# Altium schematic sheet CLK_GEN.SchDoc: Clock generation
size 420 x 297 mm; Author: P. Zdunek; DrawnBy: P. Zdunek; DocumentNumber: 17; SheetNumber: 17; SheetTotal: 37; ModifiedBy: -; CheckedDate: -; Title2: Fast Stabilizer; DivGrp: WUT ISE; Designer: G.Kasprowicz
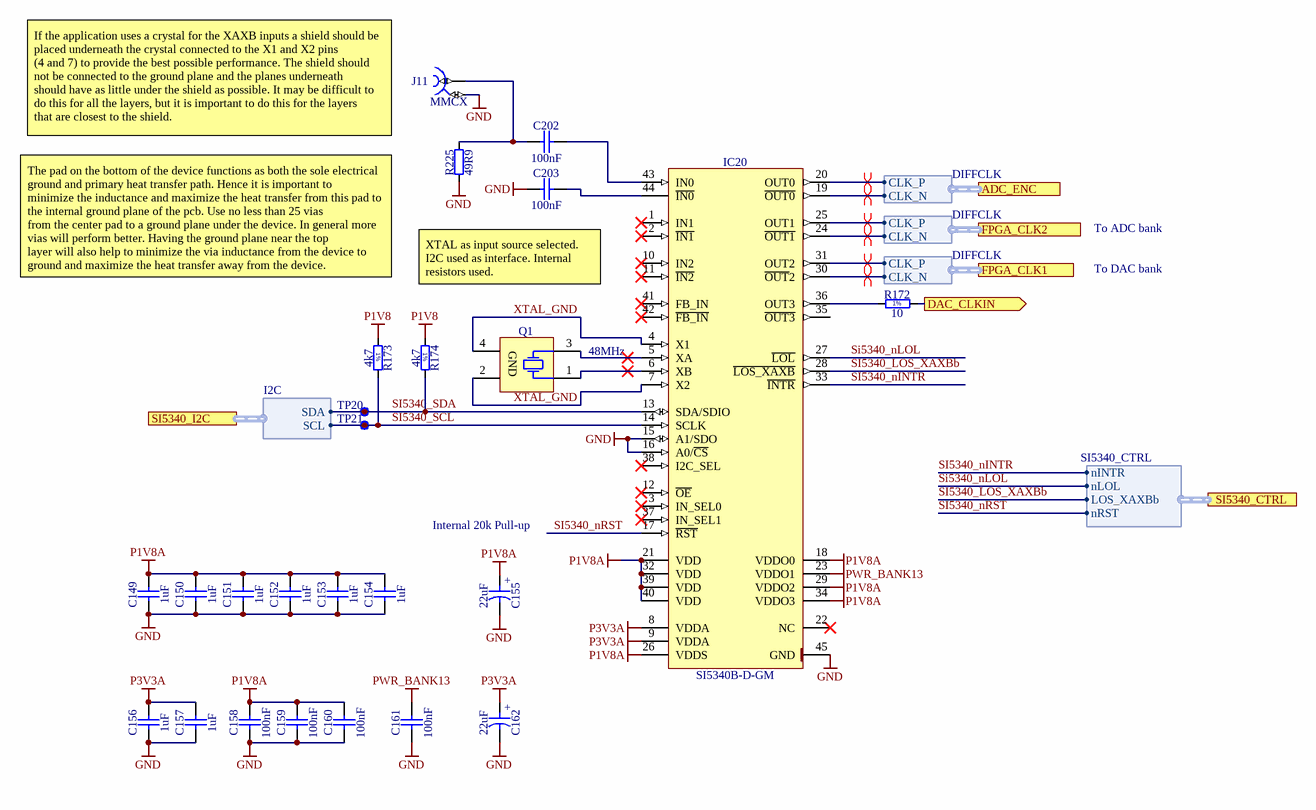
[diagram p0: CLK_GEN.SchDoc]

## Parts
C149  1uF  [CAPC1005X55N]
C150  1uF  [CAPC1005X55N]
C151  1uF  [CAPC1005X55N]
C152  1uF  [CAPC1005X55N]
C153  1uF  [CAPC1005X55N]
C154  1uF  [CAPC1005X55N]
C155  22uF  [CAPMP3216X180N]
C156  1uF  [CAPC1005X55N]
C157  1uF  [CAPC1005X55N]
C158  100nF  [CAPC1005X55N]
C159  100nF  [CAPC1005X55N]
C160  100nF  [CAPC1005X55N]
C161  100nF  [CAPC1005X55N]
C162  22uF  [CAPMP3216X180N]
C202  100nF  [CAPC1005X55N]
C203  100nF  [CAPC1005X55N]
IC20  SI5340B-D-GM  [QFN50P700X700X90-45N-S530]
J11  MMCX  [SAMTEC_MMCX-J-P-H-ST-TH1]
Q1  48MHz  [XTAL_TXC_7M]
R172  10  [RESC1005X40N]
R173  4k7  [RESC1005X40N]
R174  4k7  [RESC1005X40N]
R225  49R9  [RESC1005X40N]
TP20  SMD Pad  [C100]  (value not drawn)  (no BOM)
TP21  SMD Pad  [C100]  (value not drawn)  (no BOM)

## Ports
ADC_ENC (harness DIFFCLK), DAC_CLKIN (out), FPGA_CLK1 (harness DIFFCLK), FPGA_CLK2 (harness DIFFCLK), SI5340_CTRL (harness SI5340_CTRL), SI5340_I2C (harness I2C)

## Harnesses
SI5340_CTRL: nINTR, nLOL, LOS_XAXBb, nRST
I2C: SDA, SCL
DIFFCLK: CLK_P, CLK_N

## Nets
GND: C149.1 C150.1 C151.1 C152.1 C153.1 C154.1 C155.2 C156.1 C157.1 C158.1 C159.1 C160.1 C161.1 C162.2 C203.1 IC20.15(A1/SDO) IC20.16(A0/~{CS}) IC20.45(GND) J11.2 R225.1
P1V8: R173.1 R174.1
P1V8A: C149.2 C150.2 C151.2 C152.2 C153.2 C154.2 C155.1 C158.2 C159.2 C160.2 IC20.18(VDDO0) IC20.21(VDD) IC20.26(VDDS) IC20.29(VDDO2) IC20.32(VDD) IC20.34(VDDO3) IC20.39(VDD) IC20.40(VDD)
P3V3A: C156.2 C157.2 C162.1 IC20.8(VDDA) IC20.9(VDDA)
PWR_BANK13: C161.2 IC20.23(VDDO1)
DAC_CLKIN: R172.2 ; port DAC_CLKIN
SI5340_LOS_XAXBb: IC20.28(~{LOS_XAXB}) ; port SI5340_CTRL.LOS_XAXBb
SI5340_nINTR: IC20.33(~{INTR}) ; port SI5340_CTRL.nINTR
Si5340_nLOL: IC20.27(~{LOL}) ; port SI5340_CTRL.nLOL
SI5340_nRST: IC20.17(~{RST}) ; port SI5340_CTRL.nRST
SI5340_SCL: IC20.14(SCLK) R173.2 TP21.1 ; port SI5340_I2C.SCL
SI5340_SDA: IC20.13(SDA/SDIO) R174.2 TP20.1 ; port SI5340_I2C.SDA
XTAL_GND: IC20.4(X1) IC20.7(X2) Q1.2(GND) Q1.4(GND)
NetC202_1: C202.1 J11.1 R225.2
NetC202_2: C202.2 IC20.43(IN0)
NetC203_2: C203.2 IC20.44(~{IN0})
NetIC20_5: IC20.5(XA) Q1.3(X)
NetIC20_6: IC20.6(XB) Q1.1(X)
NetIC20_19: IC20.19(~{OUT0}) ; port ADC_ENC.CLK_N
NetIC20_20: IC20.20(OUT0) ; port ADC_ENC.CLK_P
NetIC20_24: IC20.24(~{OUT1}) ; port FPGA_CLK2.CLK_N
NetIC20_25: IC20.25(OUT1) ; port FPGA_CLK2.CLK_P
NetIC20_30: IC20.30(~{OUT}2) ; port FPGA_CLK1.CLK_N
NetIC20_31: IC20.31(OUT2) ; port FPGA_CLK1.CLK_P
NetIC20_36: IC20.36(OUT3) R172.1

Not connected (* = marked no-connect by the designer): IC20 1(IN1)* 2(~{IN1})* 3(IN_SEL0)* 10(IN2)* 11(~{IN2})* 12(~{OE})* 22(NC)* 35(~{OUT3}) 37(IN_SEL1)* 38(I2C_SEL)* 41(FB_IN)* 42(~{FB_IN})*

## Layout directives
differential pair: NetIC20_19, NetIC20_20, NetIC20_24, NetIC20_25, NetIC20_30, NetIC20_31

## Notes on the sheet
- If the application uses a crystal for the XAXB inputs a shield should be placed underneath the crystal connected to the X1 and X2 pins
  (4 and 7) to provide the best possible performance. The shield should not be connected to the ground plane and the planes underneath
  should have as little under the shield as possible. It may be difficult to do this for all the layers, but it is important to do this for the layers
  that are closest to the shield.
- To ADC bank
- The pad on the bottom of the device functions as both the sole electrical ground and primary heat transfer path. Hence it is important to
  minimize the inductance and maximize the heat transfer from this pad to the internal ground plane of the pcb. Use no less than 25 vias
  from the center pad to a ground plane under the device. In general more vias will perform better. Having the ground plane near the top
  layer will also help to minimize the via inductance from the device to ground and maximize the heat transfer away from the device.
- XTAL as input source selected. I2C used as interface. Internal resistors used.
- To DAC bank
- Internal 20k Pull-up
- Project/Equipment
- Document
- Designer
- Drawn by
- Check.by
- Copyright WUT ISE 2020.
  This documentation describes Open Hardware and is licensed under the CERN OHL v.1.2. You may redistribute and modify this documentation under the terms of the CERN OHL v.1.2. (http://ohwr.org/CERNOHL). This documentation is distributed WITHOUT ANY EXPRESS OR IMPLIED WARRANTY, INCLUDING OF MERCHANTABILITY, SATISFACTORY QUALITY AND FITNESS FOR A PARTICULAR PURPOSE. Please see the CERN OHL v.1.2 for applicable conditions.
- Contact
- File
- Last Mod.
- Print Date
- Sheet
- Size
- A3
- of
- Rev
- (in symbol CTE3216-18_22UF_10V_10%) +
- (in symbol R0402_4K7_1%_0.0625W_100PPM) 1%
- (in symbol R0402_10R_1%_0.0625W_200PPM) 1%

## Library data of the parts
C149-C154 C156 C157 = CC0402_1UF_16V_10%_X5R: Non-polarised capacitor; Part Description: SMD Multilayer Chip Ceramic Capacitor; Manufacturer: GENERIC; Manufacturer1 Part Number: C1005X5R1C105KT; Voltage: 16V; TC: X5R; Tolerance: ±10%; Part Number: CC0402_1UF_16V_10%_X5R; Component Kind: Standard; Component Type: Standard; Pin Count: 2; Value: 1uF; Status: Preferred; Manufacturer Part Number: CC0402_1UF_16V_10%_X5R; Case: 0402; Mounted: Yes; Socket: No; SMD: Yes; Sense: No; Manufacturer1 Example: TDK; Manufacturer1 ComponentHeight: 0.55mm; HelpURL: \\cern.ch\dfs\Applications\Altium\Datasheets\CC0402_X5R_TDK_C.pdf; Author: CERN DEM JLC; CreateDate: 25-Oct-12; LatestRevisionDate: 25-Oct-12
C155 C162 = CTE3216-18_22UF_10V_10%: Polarised capacitor; Part Description: Solid Tantalum Chip Capacitor; Manufacturer: GENERIC; Manufacturer1 Part Number: TAJA226K010R; Voltage: 10V; Tolerance: ±10%; Part Number: CTE3216-18_22UF_10V_10%; Component Kind: Standard; Component Type: Standard; Pin Count: 2; Value: 22uF; Status: Preferred; Manufacturer Part Number: CTE3216-18_22UF_10V_10%; Case: A; Mounted: Yes; Socket: No; SMD: Yes; Sense: No; Manufacturer1 Example: AVX; Manufacturer1 ComponentHeight: 1.8mm; HelpURL: \\cern.ch\dfs\Applications\Altium\Datasheets\CTE_AVX_TAJ.pdf; Author: CERN DEM JLC; CreateDate: 03.12.2007; LatestRevisionDate: 03.12.2007
C158-C161 C202 C203 = CC0402_100NF_16V_10%_X5R: Non-polarised capacitor; Part Description: SMD Multilayer Chip Ceramic Capacitor; Manufacturer: GENERIC; Manufacturer1 Part Number: GRM155R61C104KA88D; Voltage: 16V; TC: X5R; Tolerance: ±10%; Part Number: CC0402_100NF_16V_10%_X5R; Component Kind: Standard; Component Type: Standard; Pin Count: 2; Value: 100nF; Status: None; Manufacturer Part Number: CC0402_100NF_16V_10%_X5R; Case: 0402; Mounted: Yes; Socket: No; SMD: Yes; Sense: No; Manufacturer1 Example: MURATA; Manufacturer1 ComponentHeight: 0.55mm; HelpURL: \\cern.ch\dfs\Applications\Altium\Datasheets\CC0402_X5R_MURATA_GRM.pdf; Author: CERN DEM JLC; CreateDate: 10/12/2013; LatestRevisionDate: 10/12/2013
IC20 = SI5340B-D-GM: Low-Jitter, 10 or 4-Output, Any-Frequency, Any-Output Clock Generator; Manufacturer: SILICON LABS; PressFit: No; Bonding: No; Part Number: SI5340B-D-GM; Component Kind: Standard; Component Type: Standard; Device: SI5340B-D-GM; PackageDescription: QFN,0.50mm Pitch, Square; 44 Pin, 7.00mm L X 7.00mm W X 0.90mm H Body (W/Thermal Tab 5.3mm X 5.3mm), IPC Medium Density; Part Description: Low-Jitter, 10 or 4-Output, Any-Frequency, Any-Output Clock Generator; Manufacturer Part Number: SI5340B-D-GM; Pin Count: 45; Case: QFN44; Mounted: Yes; Socket: No; SMD: Yes; Sense: No; ComponentHeight: 0.9mm; Author: CERN DEM JLC; HelpURL: \\cern.ch\dfs\Applications\Altium\Datasheets\SI5340B-D-GM.pdf; CreateDate: 14-Dec-17; LatestRevisionDate: 14-Dec-17
J11 = SAMTEC_MMCX-J-P-H-ST-TH1: Part Description: Straight Through-hole 50 Ohm Micro Mini RF Jack, MMCX Series; Manufacturer: SAMTEC; PressFit: No; Part Number: SAMTEC_MMCX-J-P-H-ST-TH1; Component Kind: Standard; Component Type: Standard; Pin Count: 2; Mounted: Yes; Socket: No; SMD: No; Sense: No; Status: None; Manufacturer Part Number: MMCX-J-P-H-ST-TH1; ComponentHeight: 4.35mm; HelpURL: \\cern.ch\dfs\Applications\Altium\Datasheets\SAMTEC_MMCX-J-P-H-ST-TH1.pdf; Author: CERN DEM JLC; CreateDate: 05.12.2012; LatestRevisionDate: 05.12.2012
Q1 = XTAL_48MHZ_TXC_7M-48.000MAHV: Crystal 4 pins 1=XTAL Control 2=GND3=XTAL 4=GND; Part Description: ±30ppm 8pF -40°C to +85°C  4 Pins, 3.2x2.5X0.8mm, SMD Sealing Crystal, 7M Series; Manufacturer: TXC CORPORATION; PressFit: No; Bonding: No; Part Number: XTAL_48MHZ_TXC_7M-48.000MAHV; Component Kind: Standard; Component Type: Standard; PackageDescription: 4 Pins, 2.5x3.2mm, SMD Sealing Crystal, 7M Serie; Value: 48MHz; Manufacturer Part Number: 7M-48.000MAHV; Pin Count: 4; Mounted: Yes; Socket: No; SMD: Yes; Sense: No; ComponentHeight: 0.8mm; HelpURL: \\cern.ch\dfs\Applications\Altium\Datasheets\XTAL_TXC_7M.pdf; Author: CERN DEM MR; CreateDate: 30-May-16; LatestRevisionDate: 30-May-16
R172 = R0402_10R_1%_0.0625W_200PPM: Resistor - 1%; Part Description: General Purpose Thick Film Chip Resistor; Manufacturer: GENERIC; Manufacturer1 Part Number: 232270671009L; TC: ±200ppm/°C; PressFit: No; Part Number: R0402_10R_1%_0.0625W_200PPM; Component Kind: Standard; Component Type: Standard; Pin Count: 2; Value: 10; Status: Not Recommended; Power: 0.0625W; Tolerance: ±1%; Manufacturer Part Number: R0402_10R_1%_0.0625W_200PPM; Case: 0402; Mounted: Yes; Sense: No; Socket: No; SMD: Yes; Manufacturer1 Example: YAGEO PHYCOMP; Manufacturer1 ComponentHeight: 0.4mm; HelpURL: \\cern.ch\dfs\Applications\Altium\Datasheets\R0402_Phycomp_RC0402.pdf; Author: CERN DEM JLC; CreateDate: 24/06/2009; LatestRevisionDate: 17/10/2012
R173 R174 = R0402_4K7_1%_0.0625W_100PPM: Resistor - 1%; Part Description: General Purpose Thick Film Chip Resistor; Manufacturer: GENERIC; Manufacturer1 Part Number: 232270674702L; TC: ±100ppm/°C; PressFit: No; Part Number: R0402_4K7_1%_0.0625W_100PPM; Component Kind: Standard; Component Type: Standard; Pin Count: 2; Value: 4k7; Status: Not Recommended; Power: 0.0625W; Tolerance: ±1%; Manufacturer Part Number: R0402_4K7_1%_0.0625W_100PPM; Case: 0402; Mounted: Yes; Sense: No; Socket: No; SMD: Yes; Manufacturer1 Example: YAGEO PHYCOMP; Manufacturer1 ComponentHeight: 0.4mm; HelpURL: \\cern.ch\dfs\Applications\Altium\Datasheets\R0402_Phycomp_RC0402.pdf; Author: CERN DEM JLC; CreateDate: 12/3/2007; LatestRevisionDate: 10/17/2012
R225 = R0402_49R9_1%_0.0625W_100PPM: Resistor - 1%; Part Description: General Purpose Thick Film Chip Resistor; Manufacturer: GENERIC; Manufacturer1 Part Number: 232270674999L or RC0402FR-0749R9L; TC: ±100ppm/°C; PressFit: No; Part Number: R0402_49R9_1%_0.0625W_100PPM; Component Kind: Standard; Component Type: Standard; Pin Count: 2; Value: 49R9; Status: Not Recommended; Power: 0.0625W; Tolerance: ±1%; Manufacturer Part Number: R0402_49R9_1%_0.0625W_100PPM; Case: 0402; Mounted: Yes; Sense: No; Socket: No; SMD: Yes; Manufacturer1 Example: YAGEO PHYCOMP; Manufacturer1 ComponentHeight: 0.4mm; HelpURL: \\cern.ch\dfs\Applications\Altium\Datasheets\R0402_Phycomp_RC0402.pdf; Author: CERN DEM JLC; CreateDate: 24.10.2012; LatestRevisionDate: 24.10.2012
TP20 TP21 = SMD_PAD_D1MM: Through Hole Pad; Part Description: 1mm Diameter SMD Pad; Mounted: No; Part Number: SMD_PAD_D1MM; Component Type: Standard (No BOM); Pin Count: 1; Family: SMD Pad; Socket: No; SMD: No; Sense: No; Status: None; ComponentHeight: 0mm; HelpURL: Undefined; Author: CERN DEM JLC; CreateDate: 10-Oct-17; LatestRevisionDate: 10-Oct-17; PackageDescription: 1mm Diameter SMD Pad